# Altium schematic sheet TitlePage.SchDoc: Title
size A4; SchTemplateVer: V2.0; Author: Adam Mizerkiewicz; CompanyName: Adam Mizerkiewicz; DrawnBy: Adam Mizerkiewicz; Engineer: Adam Mizerkiewicz; Organization: Adam Mizerkiewicz; Address1: Sarnia 2/19; Address2: 61-058 Poznań; Revision: 0.0
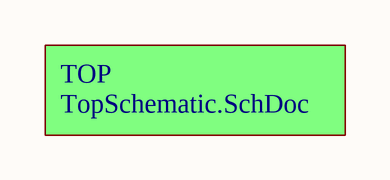
[diagram p0: TitlePage.SchDoc]

## Sub-sheets
TOP = TopSchematic.SchDoc: no entries

## Notes on the sheet
- Revision
  =Revision
- Sheet
  =SheetNumber / =SheetTotal